# EasyEDA Pro project PCB1.eprj

# Board PCB1
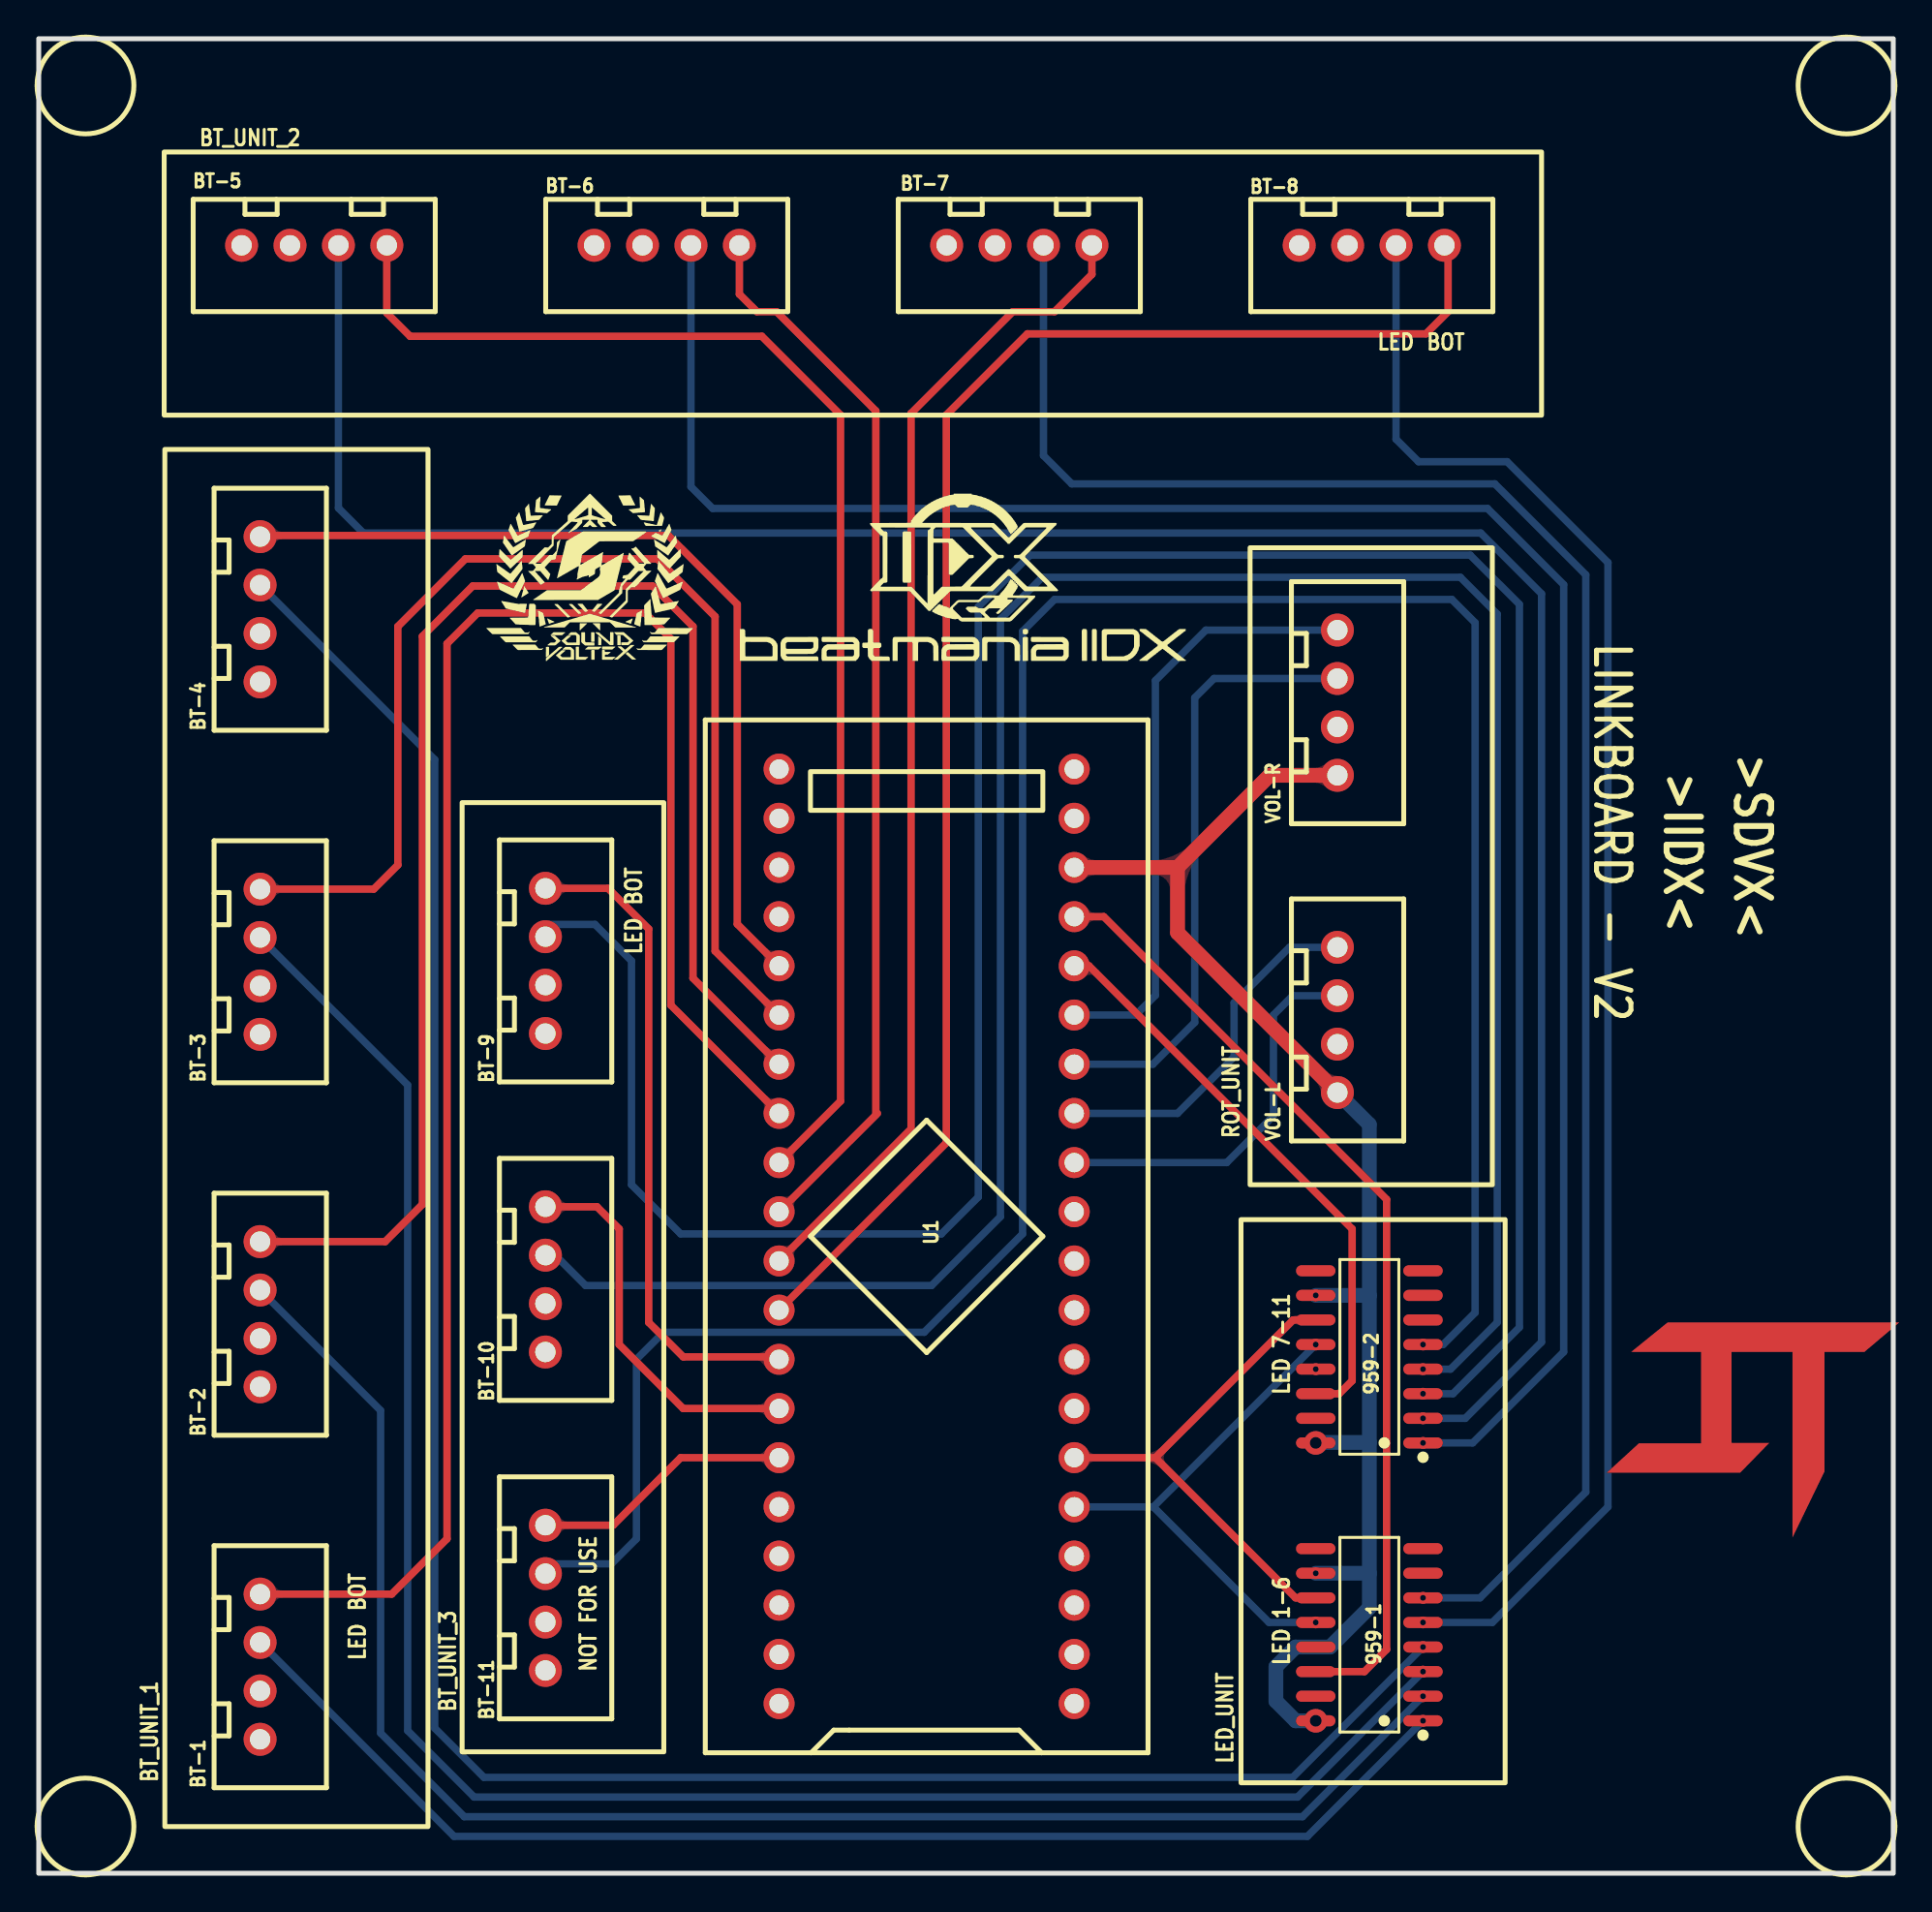
[diagram p0: board, top side]
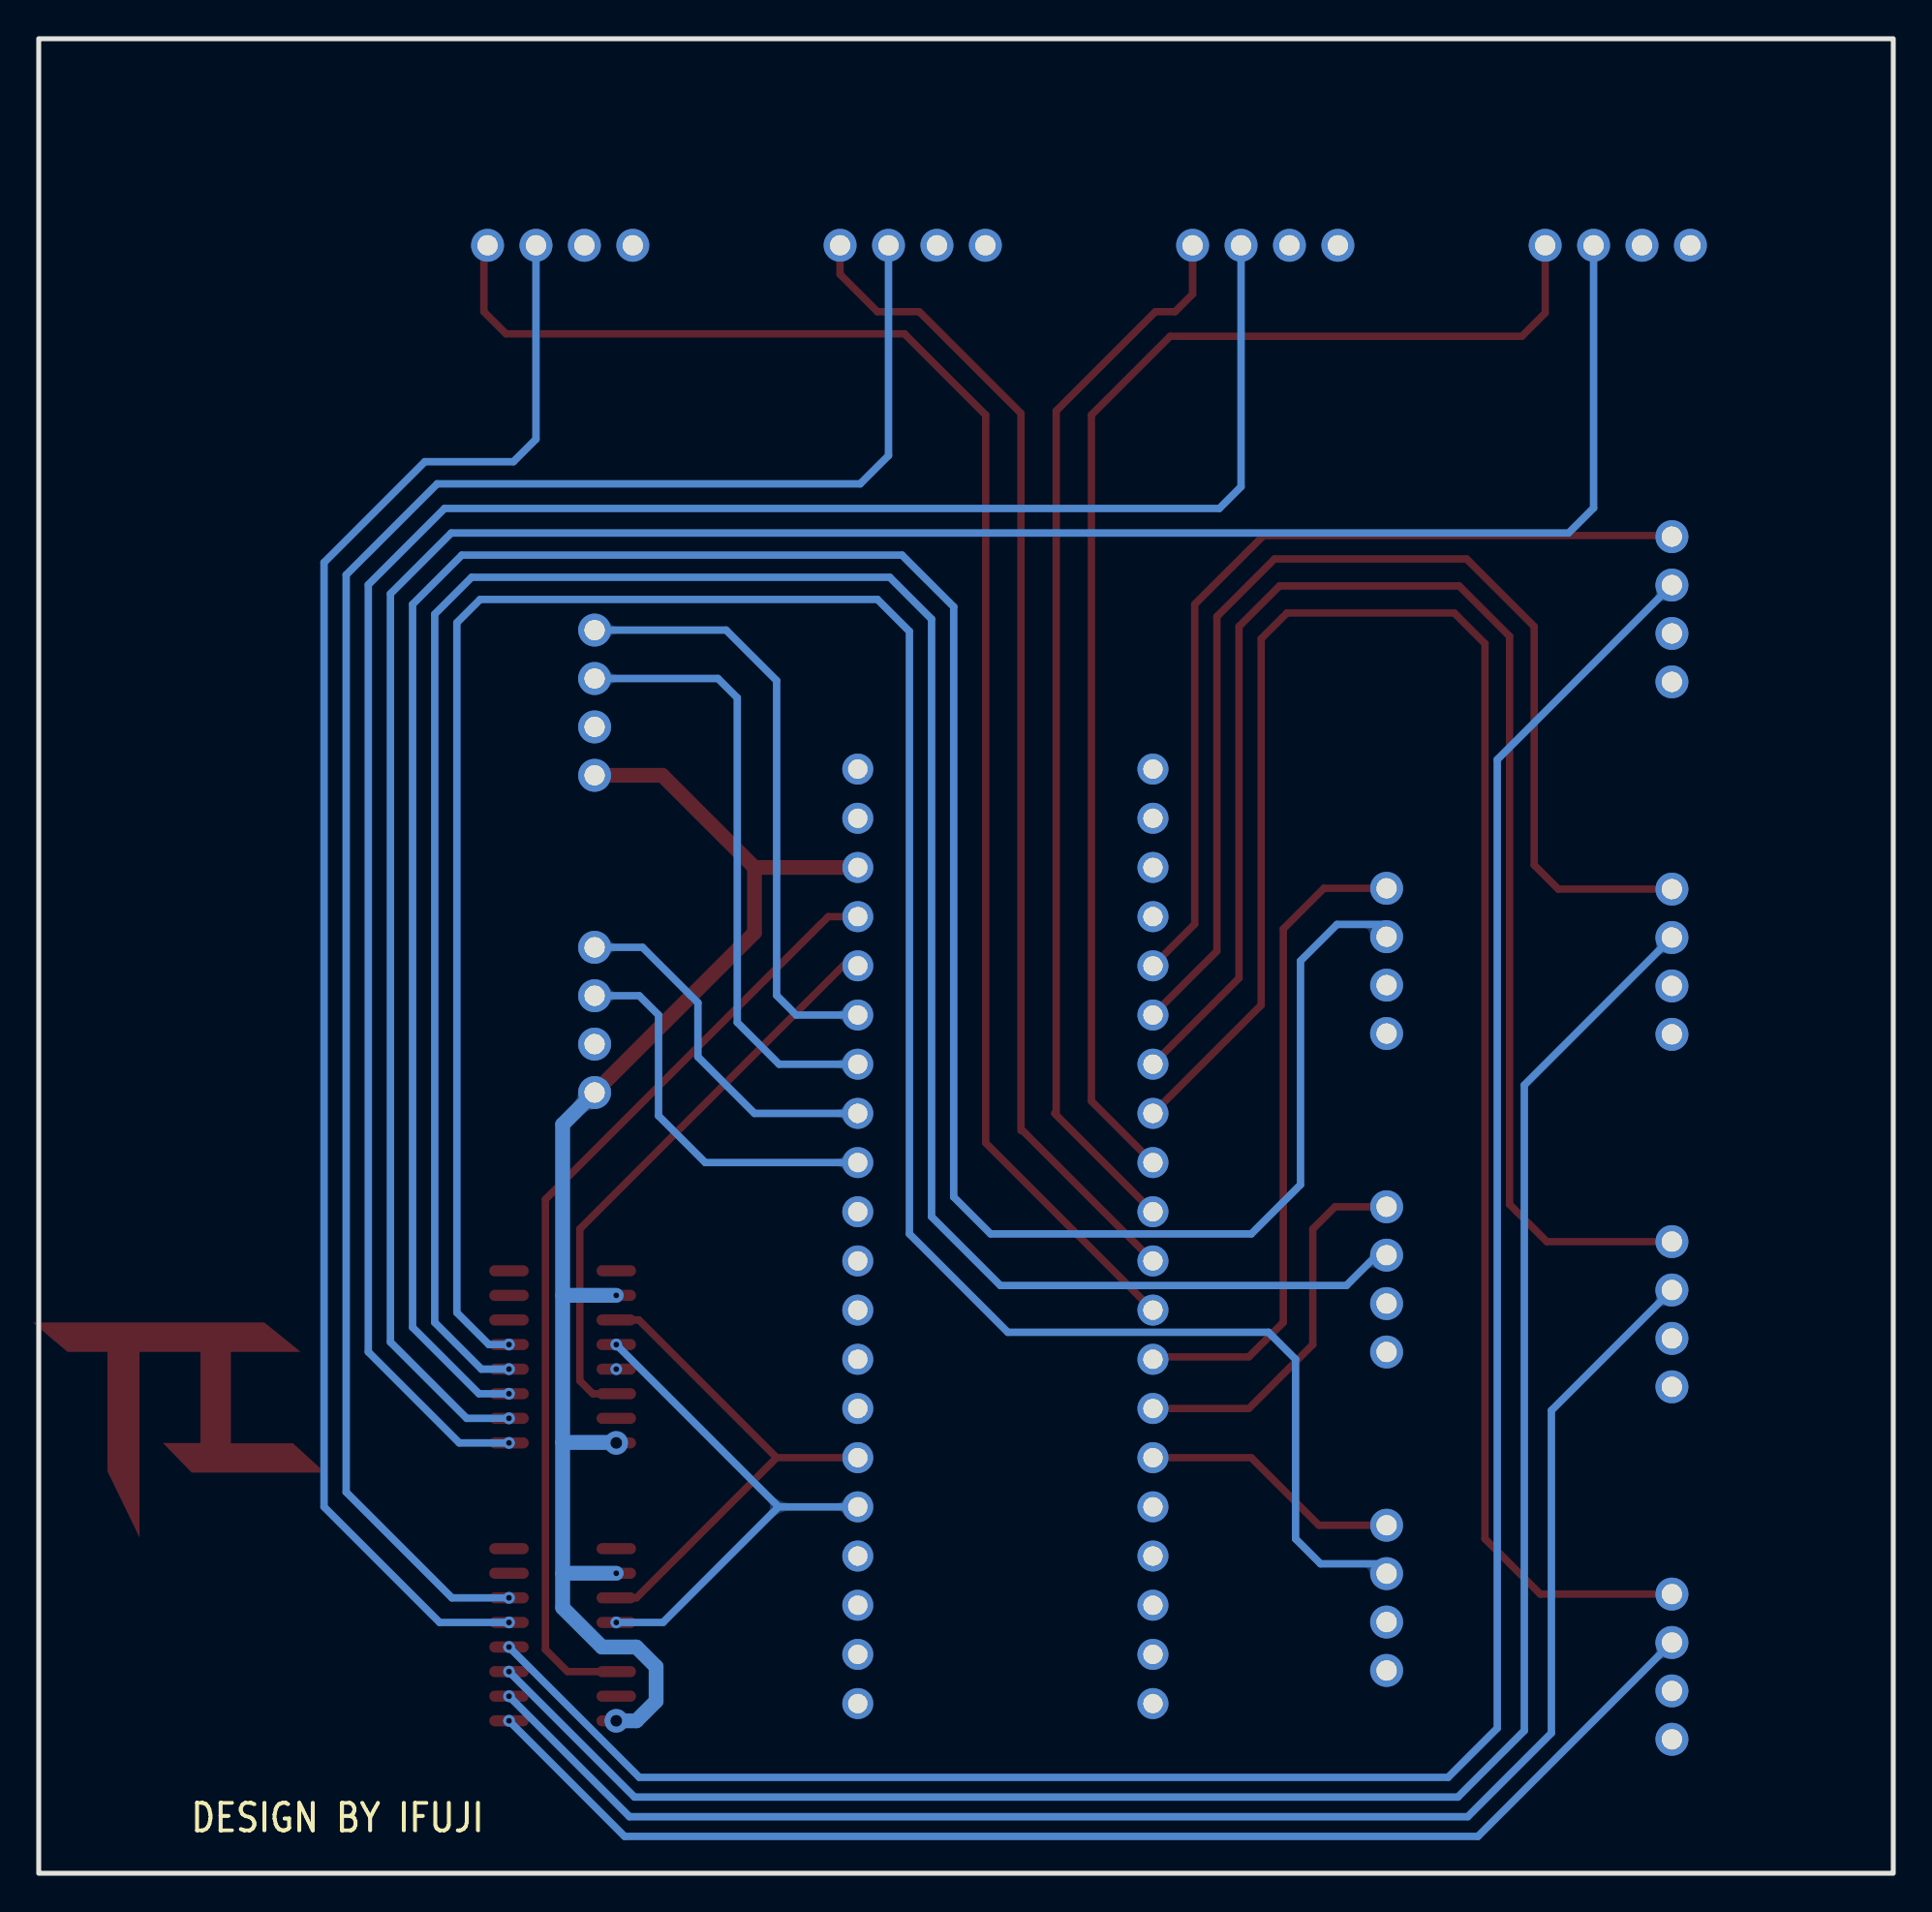
[diagram p1: board, bottom side, seen from below]

Outline 95.76 x 94.74 mm; copper layers: Top Layer, Bottom Layer. Coordinates in mm from the lower left corner of the outline.
Outline path: rectangle 0,94.74 95.76,0
Stack: Top Layer 0.035mm - / Dielectric1 1.51mm FR4 er 4.5 / Bottom Layer 0.035mm -

## Design rules (mm)
template: 自定义配置
spacing copperThickness1oz (default): track to track 0.102, other pairs 0.152 to 0.3
spacing copperThickness2oz: track to track 0.203, other pairs 0.152 to 0.3
spacing Default: track to track 0.152, other pairs 0 to 0.152
spacing 7V: track to track 0.152, other pairs 0 to 0.152
spacing 8V: track to track 0.152, other pairs 0 to 0.152
spacing 12V: track to track 0.152, other pairs 0 to 0.152
track width copperThickness1oz (default): min 0.127, default 0.254, max 2.54
track width copperThickness2oz: min 0.203, default 0.254, max 2.54
track width Default: min 0.254, default 0.254, max 25.4
track width 7V: min 1.016, default 1.016, max 25.4
track width 8V: min 1.016, default 1.016, max 25.4
track width 12V: min 1.524, default 1.524, max 25.4
differential pair differentialPair (default): width min 0.127, default 0.254, max 2.54; gap min 0.152, default 0.152
via viaSize (default): diameter min 0.5, default 0.61, max 10; hole min 0.3, default 0.305, max 6.299
via Default: diameter min 0.61, default 0.61, max 100.025; hole min 0.305, default 0.305, max 59.995
via 7V: diameter min 0.61, default 0.61, max 100.025; hole min 0.305, default 0.305, max 59.995
via 8V: diameter min 0.61, default 0.61, max 100.025; hole min 0.305, default 0.305, max 59.995
via 12V: diameter min 0.61, default 0.61, max 100.025; hole min 0.305, default 0.305, max 59.995
net GND uses gge27351

## Placement (name value [footprint] x y rotation side)
959-1  74HC595DM/TR  [SOP-16_L9.9-W3.9-P1.27-LS6.0-BL]  68.71 12.32 90 top
959-2  74HC595DM/TR  [SOP-16_L9.9-W3.9-P1.27-LS6.0-BL]  68.71 26.67 90 top
BT-1  xh2.54-4p(直针)  [CONN-TH_4P-P2.50-XH2.54-4P]  11.43 10.67 90 top
BT-2  xh2.54-4p(直针)  [CONN-TH_4P-P2.50-XH2.54-4P]  11.43 28.87 90 top
BT-3  xh2.54-4p(直针)  [CONN-TH_4P-P2.50-XH2.54-4P]  11.43 47.07 90 top
BT-4  xh2.54-4p(直针)  [CONN-TH_4P-P2.50-XH2.54-4P]  11.43 65.28 90 top
BT-5  xh2.54-4p(直针)  [CONN-TH_4P-P2.50-XH2.54-4P]  14.22 84.07 0 top
BT-6  xh2.54-4p(直针)  [CONN-TH_4P-P2.50-XH2.54-4P]  32.43 84.07 0 top
BT-7  xh2.54-4p(直针)  [CONN-TH_4P-P2.50-XH2.54-4P]  50.63 84.07 0 top
BT-8  xh2.54-4p(直针)  [CONN-TH_4P-P2.50-XH2.54-4P]  68.83 84.07 0 top
BT-9  xh2.54-4p(直针)  [CONN-TH_4P-P2.50-XH2.54-4P]  26.16 47.12 90 top
BT-10  xh2.54-4p(直针)  [CONN-TH_4P-P2.50-XH2.54-4P]  26.16 30.67 90 top
BT-11  xh2.54-4p(直针)  [CONN-TH_4P-P2.50-XH2.54-4P]  26.16 14.22 90 top
NOREF  -  [Pad_e56]  88.52 27.69 90 top
U1  LCKFB-DKX-STM32F103C8T6  [CONN-TH_L53.3-W22.9_STM32F103C8T6-CARD]  45.85 32.89 90 top
VOL-L  xh2.54-4p(直针)  [CONN-TH_4P-P2.50-XH2.54-4P]  67.06 44.07 90 top
VOL-R  xh2.54-4p(直针)  [CONN-TH_4P-P2.50-XH2.54-4P]  67.06 60.45 90 top

## Footprints (pads in the part's own frame, mm; a bottom-side part is the same pattern mirrored in y, then rotated)
CONN-TH_4P-P2.50-XH2.54-4P
  round 1.7 hole 1.05: 1(3.75,0) 2(1.25,0) 3(-1.25,0) 4(-3.75,0)
CONN-TH_L53.3-W22.9_STM32F103C8T6-CARD
  round 1.6 hole 1: 1(-24.13,-7.62) 2(-21.59,-7.62) 3(-19.05,-7.62) 4(-16.51,-7.62) 5(-13.97,-7.62) 6(-11.43,-7.62) 7(-8.89,-7.62) 8(-6.35,-7.62) 9(-3.81,-7.62) 10(-1.27,-7.62) 11(1.27,-7.62) 12(3.81,-7.62) 13(6.35,-7.62) 14(8.89,-7.62) 15(11.43,-7.62) 16(13.97,-7.62) 17(16.51,-7.62) 18(19.05,-7.62) 19(21.59,-7.62) 20(24.13,-7.62) 21(24.13,7.62) 22(21.59,7.62) 23(19.05,7.62) 24(16.51,7.62) 25(13.97,7.62) 26(11.43,7.62) 27(8.89,7.62) 28(6.35,7.62) 29(3.81,7.62) 30(1.27,7.62) 31(-1.27,7.62) 32(-3.81,7.62) 33(-6.35,7.62) 34(-8.89,7.62) 35(-11.43,7.62) 36(-13.97,7.62) 37(-16.51,7.62) 38(-19.05,7.62) 39(-21.59,7.62) 40(-24.13,7.62)
Pad_e56
  custom 11.107x15.095 smd: 41(0,0)
SOP-16_L9.9-W3.9-P1.27-LS6.0-BL
  oval 0.574x2.038 smd: 1(-4.445,-2.769) 2(-3.175,-2.769) 3(-1.905,-2.769) 4(-0.635,-2.769) 5(0.635,-2.769) 6(1.905,-2.769) 7(3.175,-2.769) 8(4.445,-2.769) 9(4.445,2.769) 10(3.175,2.769) 11(1.905,2.769) 12(0.635,2.769) 13(-0.635,2.769) 14(-1.905,2.769) 15(-3.175,2.769) 16(-4.445,2.769)

## Nets
+5V: 959-1.10 959-1.16 959-2.10 959-2.16 U1.18 VOL-L.4 VOL-R.4
GND: 959-1.8 959-1.13 959-2.8 959-2.13 BT-1.3 BT-1.4 BT-2.3 BT-2.4 BT-3.3 BT-3.4 BT-4.3 BT-4.4 BT-5.3 BT-5.4 BT-6.3 BT-6.4 BT-7.3 BT-7.4 BT-8.3 BT-8.4 BT-9.3 BT-9.4 BT-10.3 BT-10.4 BT-11.3 BT-11.4 NOREF.41 U1.19 U1.39 U1.40 VOL-L.3 VOL-R.3
BOTA: BT-4.1 U1.25
BOTB: BT-3.1 U1.26
BOTC: BT-2.1 U1.27
BOTD: BT-1.1 U1.28
BT-8: BT-8.1 U1.32
BT-9: BT-9.1 U1.33
BT-10: BT-10.1 U1.34
BT-11: BT-11.1 U1.35
CLK: 959-1.11 959-2.11 U1.6
FXL: BT-7.1 U1.31
FXR: BT-6.1 U1.30
LED8: 959-1.5 BT-8.2
LED9: 959-2.3 BT-9.2
LED10: 959-2.4 BT-10.2
LED11: 959-2.5 BT-11.2
LEDA: 959-1.4 BT-4.2
LEDB: 959-1.3 BT-3.2
LEDC: 959-1.2 BT-2.2
LEDD: 959-1.1 BT-1.2
LEDFXL: 959-1.6 BT-7.2
LEDFXR: 959-2.1 BT-6.2
LEDSTART: 959-2.2 BT-5.2
LM: 959-1.12 959-2.12 U1.5
R1DS: 959-1.14 U1.17
R2DS: 959-2.14 U1.16
START: BT-5.1 U1.29
VOLLA: U1.13 VOL-L.1
VOLLB: U1.12 VOL-L.2
VOLRA: U1.15 VOL-R.1
VOLRB: U1.14 VOL-R.2

Pads without a net: 959-1 7 9 15; 959-2 6 7 9 15; U1 1 2 3 4 7 8 9 10 11 20 21 22 23 24 36 37 38

## Via types
v1: diameter 0.61, hole 0.305, Top Layer to Bottom Layer, 16 vias
v2: diameter 1.219, hole 0.61, Top Layer to Bottom Layer, 2 vias

## Routing (per net, layer and track width the routed paths; a pad name or vN(x,y) marks a point on that pad's centre or on a via; arc(x,y) is an arc through that point)
+5V: length 76.5
  Top Layer w0.762: VOL-R.4 63.56,56.7 58.8,51.94 ; 58.8,51.94 U1.18 ; 58.8,51.94 58.8,48.57 VOL-L.4
  Bottom Layer w0.762: 68.71,29.84 v1(65.94,29.84) ; 68.71,29.84 68.71,38.67 VOL-L.4 ; 68.71,29.84 68.71,22.25 ; 68.71,15.49 68.71,13.72 66.68,11.68 64.9,11.68 63.88,10.67 63.88,8.89 64.9,7.87 65.91,7.87 ; 68.71,15.49 v1(65.94,15.49) ; 68.71,15.49 68.71,22.25 ; v2(65.94,22.22) 65.96,22.25 68.71,22.25
  vias: v2(65.94,7.87)
GND:
  vias: v1(65.94,26.03)
BOTA: length 45.7
  Top Layer w0.381: BT-4.1 11.49,69.09 32.51,69.09 36.07,65.53 36.07,49.02 U1.25
BOTB: length 61
  Top Layer w0.381: U1.26 34.93,47.62 34.93,64.9 31.94,67.88 22.03,67.88 18.54,64.39 18.54,52.07 17.3,50.82 11.43,50.82
BOTC: length 78.9
  Top Layer w0.381: U1.27 33.78,46.23 33.78,64.39 31.69,66.48 22.41,66.48 19.81,63.88 19.81,34.54 17.89,32.62 BT-2.1
BOTD: length 96.7
  Top Layer w0.381: BT-1.1 18.23,14.42 21.08,17.27 21.08,63.5 22.67,65.08 31.31,65.08 32.64,63.75 32.64,44.83 U1.28
BT-8: length 81.4
  Top Layer w0.381: U1.32 46.86,37.72 46.86,75.31 51.05,79.5 71.63,79.5 72.77,80.64 72.77,83.89 BT-8.1
BT-9: length 34
  Top Layer w0.381: BT-9.1 29.4,50.87 31.5,48.77 31.5,28.45 33.27,26.67 38.1,26.67 U1.33
BT-10: length 19.9
  Top Layer w0.381: U1.34 33.27,24 29.97,27.3 29.97,33.27 28.83,34.42 BT-10.1
BT-11: length 13.5
  Top Layer w0.381: U1.35 33.15,21.46 29.66,17.97 BT-11.1
CLK: length 26.7
  Top Layer w0.381: 959-2.11 64.77,28.57 57.66,21.46 ; 57.66,21.46 64.9,14.22 959-1.11 ; 57.66,21.46 U1.6
FXL: length 60.4
  Top Layer w0.381: 45.04,38.35 45.04,75.4 50.29,80.64 52.45,80.64 54.38,82.57 BT-7.1 ; 44.96,38.35 U1.31
FXR: length 55.5
  Top Layer w0.381: 43.22,39.24 43.22,75.52 38.1,80.64 37.08,80.64 36.18,81.55 BT-6.1 ; U1.30 43.31,39.24
LED8: length 84.4
  Bottom Layer w0.381: BT-8.2 70.08,74.06 71.25,72.9 75.82,72.9 81.03,67.69 81.03,18.92 75.06,12.95 v1(71.48,12.95)
LED9: length 140.8
  Bottom Layer w0.381: v1(71.48,24.76) 73.03,24.76 76.45,28.19 76.45,65.53 73.91,68.07 51.18,68.07 48.51,65.4 48.51,34.92 46.61,33.02 33.15,33.02 30.61,35.56 30.61,47.12 28.72,49 26.16,49
LED10: length 125.4
  Bottom Layer w0.381: v1(71.48,26.03) 72.9,26.03 75.31,28.45 75.31,65.02 73.41,66.93 51.82,66.93 49.66,64.77 49.66,33.91 46.1,30.35 28.24,30.35 26.16,32.43
LED11: length 131.8
  Bottom Layer w0.381: 26.16,15.98 29.57,15.98 30.86,17.27 30.86,26.54 32.26,27.94 45.72,27.94 50.8,33.02 50.8,64.13 52.45,65.79 72.96,65.79 74.17,64.58 74.17,28.96 72.52,27.3 v1(71.48,27.3)
LEDA: length 117.6
  Bottom Layer w0.381: BT-4.2 20.45,57.51 20.45,7.49 22.99,4.95 64.75,4.95 v1(71.48,11.68)
LEDB: length 100.6
  Bottom Layer w0.381: v1(71.48,10.41) 65,3.94 22.48,3.94 19.05,7.37 19.05,40.7 BT-3.2
LEDC: length 83.6
  Bottom Layer w0.381: BT-2.2 17.65,23.9 17.65,7.24 21.97,2.92 65.25,2.92 v1(71.48,9.14)
LEDD: length 66.7
  Bottom Layer w0.381: v1(71.48,7.87) 65.51,1.91 21.44,1.91 BT-1.2
LEDFXL: length 99.5
  Bottom Layer w0.381: BT-7.2 51.88,73.21 53.34,71.75 75.18,71.75 79.88,67.06 79.88,19.69 74.42,14.22 v1(71.48,14.22)
LEDFXR: length 108.5
  Bottom Layer w0.381: BT-6.2 33.68,71.61 34.8,70.48 74.8,70.48 78.74,66.55 78.74,26.92 74.04,22.22 v1(71.48,22.22)
LEDSTART: length 123.9
  Bottom Layer w0.381: BT-5.2 15.47,70.5 16.76,69.21 74.46,69.21 77.6,66.07 77.6,27.43 73.66,23.49 v1(71.48,23.49)
LM: length 26.8
  Bottom Layer w0.381: 57.56,18.92 63.53,12.95 v1(65.94,12.95) ; 57.56,18.92 U1.5 ; 57.56,18.92 v1(65.94,27.3)
R1DS: length 49.6
  Top Layer w0.381: U1.17 54.99,49.4 69.6,34.8 69.6,11.56 68.45,10.41 959-1.14
R2DS: length 30
  Top Layer w0.381: U1.16 54.23,46.86 67.82,33.27 67.82,25.44 67.15,24.76 959-2.14
START: length 69
  Top Layer w0.381: U1.29 41.4,39.88 41.4,75.31 37.34,79.37 19.18,79.37 17.97,80.58 BT-5.1
VOLLA: length 18.8
  Bottom Layer w0.381: U1.13 58.8,39.24 61.72,42.16 61.72,44.96 64.58,47.82 VOL-L.1
VOLLB: length 20.2
  Bottom Layer w0.381: VOL-L.2 64.75,45.32 63.75,44.32 63.75,39.12 61.34,36.7 U1.12
VOLRA: length 31.3
  Bottom Layer w0.381: U1.15 56.64,44.32 57.66,45.34 57.66,61.59 60.26,64.2 VOL-R.1
VOLRB: length 31.7
  Bottom Layer w0.381: VOL-R.2 60.69,61.7 59.69,60.71 59.69,43.94 57.53,41.78 U1.14

## Copper pours and planes (outline as drawn; the poured copper is in the pictures)
GND on Top Layer: 0,94.74 95.76,94.74 95.76,0 0,0
GND on Bottom Layer: -0.13,94.87 95.63,94.87 95.63,0.13 -0.13,0.13

Small or netless copper shapes (teardrops, artwork), in the pictures only: 29 on Top Layer, 29 on Bottom Layer

## Text on the board
Bottom Silkscreen Layer: DESIGN BY IFUJI
Top Silkscreen Layer: BT_UNIT_2 | LED | BOT | NOT FOR USE | ROT_UNIT | BT_UNIT_3 | LED_UNIT | LED 7-11 | LED 1-6 | BT_UNIT_1 | LINKBOARD - V2 | >IIDX< | >SDVX<
